# EasyEDA Pro project CW-LINK.epro

# Schematic schematic
Create Date: 2023-11-06; Page Name: CW; Project Name: CW1; Schematic Name: schematic2; Update Date: 2023-11-06; Company: 嘉立创EDA; Page Size: A4; Version: V1.0
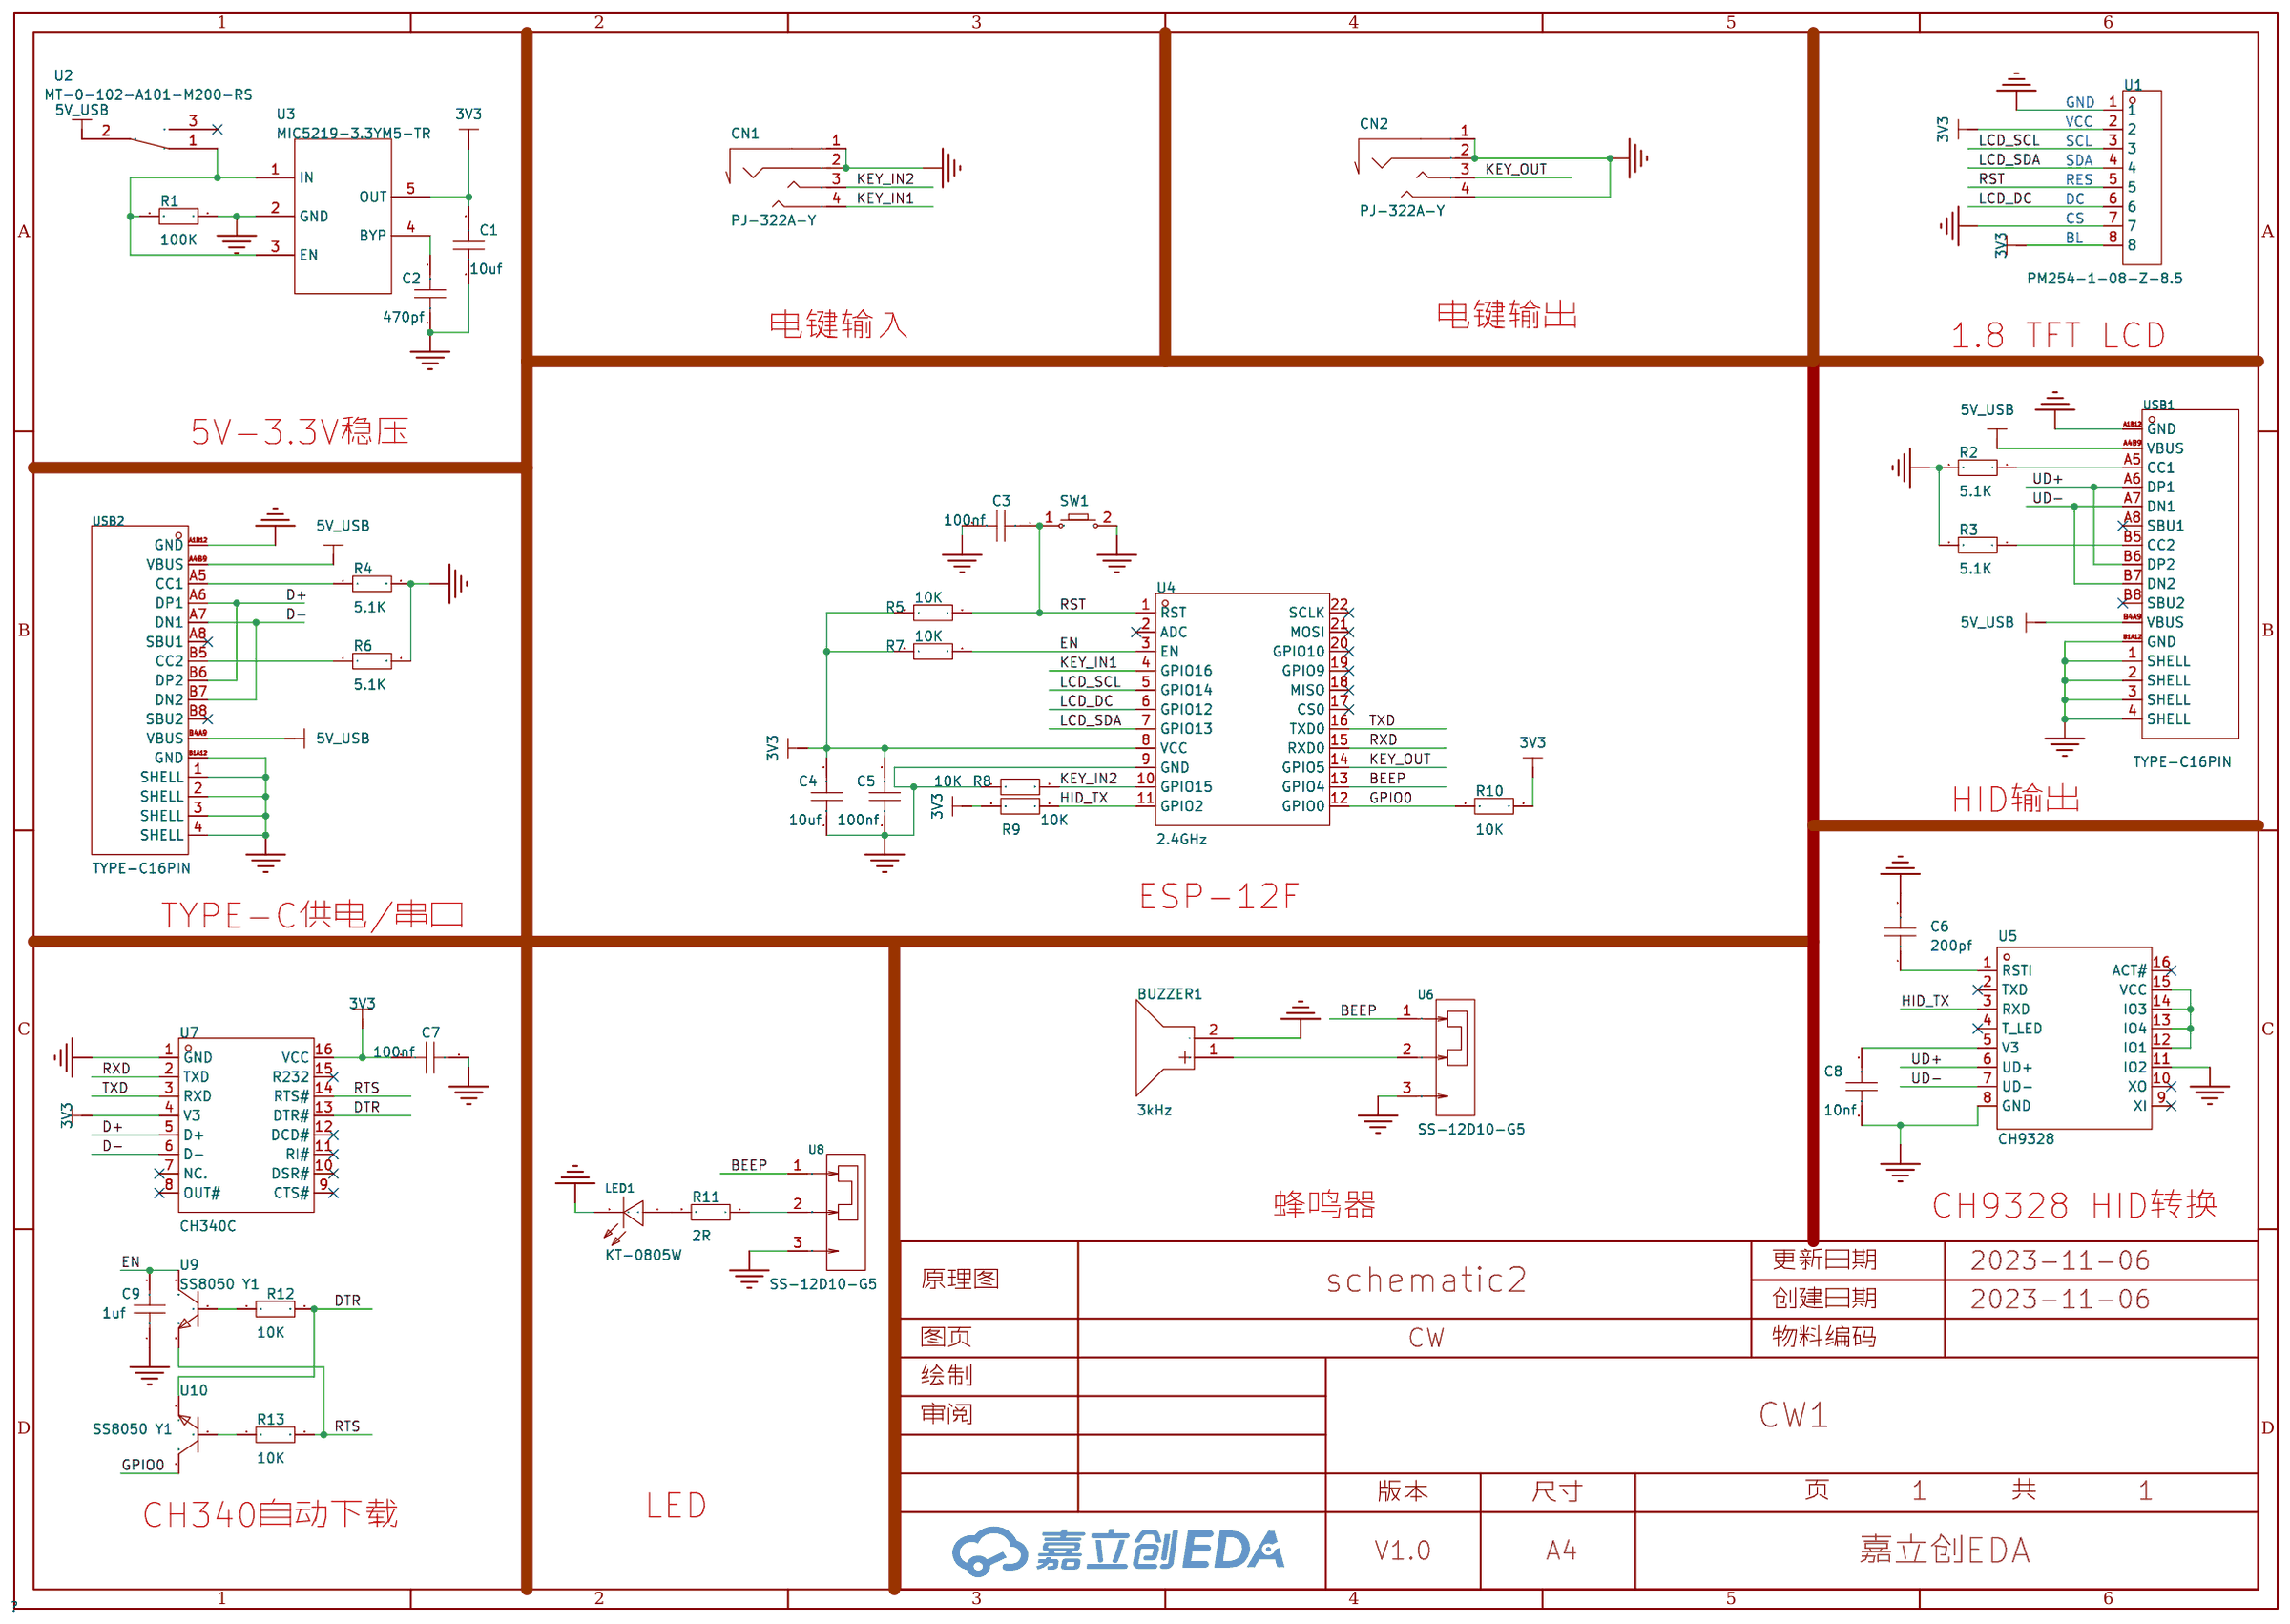
[diagram p0: schematic sheet]

## Parts
BUZZER1  3kHz  [BUZ-TH_BD9.0-P5.00-D0.6-FD]
C1  10uf  [C0603]
C2  470pf  [C0603]
C3  100nf  [C0603]
C4  10uf  [C0603]
C5  100nf  [C0603]
C6  200pf  [C0603]
C7  100nf  [C0603]
C8  10nf  [C0603]
C9  1uf  [C0603]
CN1  PJ-322A-Y  [AUDIO-TH_PJ-322A-Y]
CN2  PJ-322A-Y  [AUDIO-TH_PJ-322A-Y]
LED1  KT-0805W  [LED0805-R-RD]
R1  100K  [R0603]
R2  5.1K  [R0603]
R3  5.1K  [R0603]
R4  5.1K  [R0603]
R5  10K  [R0603]
R6  5.1K  [R0603]
R7  10K  [R0603]
R8  10K  [R0603]
R9  10K  [R0603]
R10  10K  [R0603]
R11  2R  [R0603]
R12  10K  [R0603]
R13  10K  [R0603]
SW1  -  [Key_SMD_3x4x2]
U1  PM254-1-08-Z-8.5  [HDR-TH_8P-P2.54-V-F]
U2  MT-0-102-A101-M200-RS  [SW-TH_MT-0-103-A101-M200-RS]
U3  MIC5219-3.3YM5-TR  [SOT-23-5_L3.0-W1.7-P0.95-LS2.8-TL]
U4  2.4GHz  [WIFIM-SMD_ESP-12F-ESP8266MOD]
U5  CH9328  [SOP-16_L10.0-W3.9-P1.27-LS6.0-BL]
U6  SS-12D10-G5  [SW-TH_SS-12D10-G050]
U7  CH340C  [SOP-16_L10.0-W3.9-P1.27-LS6.0-BL]
U8  SS-12D10-G5  [SW-TH_SS-12D10-G050]
U9  SS8050 Y1  [SOT-23-3_L2.9-W1.3-P1.90-LS2.4-BR]
U10  SS8050 Y1  [SOT-23-3_L2.9-W1.3-P1.90-LS2.4-BR]
USB1  TYPE-C16PIN  [USB-C-SMD_TYPE-C16PIN]
USB2  TYPE-C16PIN  [USB-C-SMD_TYPE-C16PIN]

## Library data of the parts
BUZZER1 = HNB09A03: 驱动方式:有源(内含驱动线路);构造类型:电磁式;额定电压:3V;工作电压:1.5V~4.5V;消耗电流:30mA;频率:3kHz;声压(SPL):85dB@10cm;直径(φD):9mm;长度:-;宽度:-;高度:5.5mm;工作温度:-20℃~+70℃;; LCSC Part Name: 电磁式有源一体蜂鸣器HNB09A03; Supplier Part: C96102; Manufacturer: 华能; Supplier Footprint: 插件,D=9mm; JLCPCB Part Class: 扩展库; Datasheet: https://atta.szlcsc.com/upload/public/pdf/source/20170522/1495448326172.pdf; Supplier: LCSC; Oscillator Circuit: 有源(内含驱动线路); Technology Type: 电磁式; Rated Voltage: 3V; Operating Voltage: 1.5V~4.5V; Current Consumption: 30mA; Sound Pressure Level (SPL): 85dB@10cm; Diameter (φD): 9mm; Height: 5.5mm; Operating Temperature: -20℃~+70℃
C1-C9 = CAP_0603: Supplier Footprint: 0603; Check: false
CN1 CN2 = PJ-322A-Y: 连接器类型:3.5mm耳机座;额定电流:500mA;额定电压:30V;工作温度范围:-20℃~+70℃;焊接温度(最大值):235℃;; LCSC Part Name: 3.5mm耳机座 5脚4级插脚; Supplier Part: C692437; Manufacturer: XKB Connectivity(中国星坤); Supplier Footprint: 插件; JLCPCB Part Class: 扩展库; Datasheet: https://atta.szlcsc.com/upload/public/pdf/source/20211011/A7724924910CB45E8E030AEFF3716BF0.pdf; Supplier: LCSC; Connector Type: 3.5mm耳机座; Current Rating (Max): 500mA; Voltage Rating (Max): 30V; Operating Temperature Range: -20℃~+70℃; Welding Temperature (Max): 235℃
LED1 = KT-0805W: 色温6000K左右; LCSC Part Name: 0805 白灯 高亮; Supplier Part: C34499; Manufacturer: KENTO; Supplier Footprint: 0805; JLCPCB Part Class: 基础库; Datasheet: https://atta.szlcsc.com/upload/public/pdf/source/20221124/DAA20402FFC1FB071B8B6797757426FE.pdf; Supplier: LCSC
R1-R13 = Res_0603: Supplier Footprint: 0603; Check: false
SW1 = Key_SMD_3x4x2: Supplier Footprint: SMD; Check: false
U1 = PM254-1-08-Z-8.5: 排数:单排;总孔位数:8P;间距:2.54mm;插孔结构:1x8P;行距:-;安装类型:直插;圆孔/方孔:方孔;额定电流:3A;额定电压:-;插孔方向:顶部;塑高:8.5mm;工作温度范围:-40℃~+105℃;; LCSC Part Name: 间距:2.54mm 1x8P 直插; Supplier Part: C2897371; Manufacturer: HCTL(华灿天禄); Supplier Footprint: 插件,P=2.54mm; JLCPCB Part Class: 扩展库; Datasheet: https://atta.szlcsc.com/upload/public/pdf/source/20230609/534BE42964C679BDE98E061007C4ABD6.pdf; Supplier: LCSC; Number of Rows: 单排; Number of Holes: 8P; Pitch: 2.54mm; Holes Structure: 1x8P; Mounting Type: 直插; Circular Hole / Square Hole: 方孔; Current Rating (Max): 3A; Holes Direction: 顶部; Insulation Height: 8.5mm; Operating Temperature Range: -40℃~+105℃
U2 = MT-0-102-A101-M200-RS: 额定电流:5A;额定电压(AC):125V;电路结构:单刀双掷;机械寿命:-;安装方式:直插;; LCSC Part Name: 小型钮子三脚二档 五件套; Supplier Part: C1788492; Manufacturer: YUEN FUNG(源丰); Supplier Footprint: 插件; JLCPCB Part Class: 扩展库; Datasheet: https://atta.szlcsc.com/upload/public/pdf/source/20230720/8E5C36EFDF374AE4FF4AC09DB233CE0E.pdf; Supplier: LCSC; Contact Current: 5A; Voltage Rating (AC): 125V; Circuit: 单刀双掷; Actuator Type: 圆柱钮柄; Pin Style: 焊片; Mounting Style: 直插; Operating Temperature: -25℃~+85℃; Switch Length: 13mm; Switch Width: 8mm; Switch Height: 28.6mm
U3 = MIC5219-3.3YM5-TR: 输出类型:-;; Supplier Part: C29613; Manufacturer: MICROCHIP(美国微芯); Supplier Footprint: SOT-23-5; JLCPCB Part Class: 扩展库; Datasheet: https://atta.szlcsc.com/upload/public/pdf/source/20140411/1457707042508.pdf; Supplier: LCSC
U4 = ESP-12F(ESP8266MOD): 频率:2.4GHz;发射功率:16dBm;核心处理器:ESP8266;天线形式:PCB 板载天线;接收灵敏度:-90dBm;; LCSC Part Name: 完整的802.11b/g/n Wi-Fi的SoC模块; Supplier Part: C82891; Manufacturer: Ai-Thinker(安信可); Supplier Footprint: SMD,16x24mm; JLCPCB Part Class: 扩展库; Datasheet: https://atta.szlcsc.com/upload/public/pdf/source/20210219/C82891_ABD84A460F4F056A2757267CCCA4B508.pdf; Supplier: LCSC; Output Power: 16dBm; Core Processor: ESP8266; Support Interface: GPIO；UART；I2C；PWM；SPI；ADC; Antenna Type: PCB 板载天线; Wireless Standard: 802.11b/g/n; Operating Voltage: 3.3V; Receive  Current: 120mA; Send  Current: 170mA; Sensitivity: -90dBm; Operating Temperature: -40℃~+85℃
U5 = CH9328: 应用功能:收发器;接口协议:USB 2.0;数据速率:12Mbps;; Supplier Part: C82452; Manufacturer: WCH(南京沁恒); Supplier Footprint: SOP-16; JLCPCB Part Class: 扩展库; Datasheet: https://atta.szlcsc.com/upload/public/pdf/source/20200903/C82452_2CB77B87B2D4A08CA0C06489A1962735.pdf; Supplier: LCSC; Applications Function: 收发器; Protocol: USB 2.0; Data Rate: 12Mbps; Supply Voltage: 3.3V；5V
U6 U8 = SS-12D10-G5: 电路结构:单刀双掷;安装方式:直插;机械寿命:-;开关颜色:黑色;; LCSC Part Name: 插件大电流拨动开关; Supplier Part: C2998777; Manufacturer: DEALON(德艺隆); Supplier Footprint: 插件; JLCPCB Part Class: 扩展库; Datasheet: https://atta.szlcsc.com/upload/public/pdf/source/20220428/E10CB334ACBAF32CF4AF8D87DA871CD3.pdf; Supplier: LCSC; Circuit: 单刀双掷; Mounting Style: 直插; Actuator Color: 黑色; Actuator Style: 矩形柱状; Pin Style: PC引脚; Switch Length: 12.7mm; Switch Width: 6.7mm; Switch Height: 11.3mm
U7 = CH340C: 应用功能:收发器;接口协议:USB 2.0;数据速率:2Mbps;; LCSC Part Name: CH340C USB转串口芯片 CH340; Supplier Part: C84681; Manufacturer: WCH(南京沁恒); Supplier Footprint: SOP-16; JLCPCB Part Class: 扩展库; Datasheet: https://atta.szlcsc.com/upload/public/pdf/source/20200819/C84681_ADBED554CE321879DBD6B1D06488689C.pdf; Supplier: LCSC; Applications Function: 收发器; Protocol: USB 2.0; Data Rate: 2Mbps; Supply Voltage: 3.3V；5V
U9 U10 = SS8050 Y1_C5365361: 晶体管类型:NPN;集射极击穿电压(Vceo):25V;集电极电流(Ic):1.5A;功率(Pd):300mW;直流电流增益(hFE@Ic,Vce):120@100mA,1V;; LCSC Part Name: NPN 25V 1.5A; Supplier Part: C5365361; Manufacturer: JUXING(钜兴); Supplier Footprint: SOT-23; JLCPCB Part Class: 扩展库; Datasheet: https://atta.szlcsc.com/upload/public/pdf/source/20230308/FB5646DC857F3944E2D1F5B10247AD70.pdf; Supplier: LCSC; Transistor Type: NPN; Collector-Emitter Breakdown Voltage (Vceo): 25V; Collector Current (Ic): 1.5A; Power Dissipation (Pd): 300mW; Collector Cut-Off Current (Icbo): 100nA; Collector-Emitter Saturation Voltage (VCE(sat)@Ic,Ib): 500mV@800mA,80mA; DC Current Gain (hFE@Ic,Vce): 120@100mA,1V; Transition Frequency (fT): 100MHz; Operating Temperature: +150℃@(Tj)
USB1 USB2 = TYPE-C16PIN: 连接器类型:Type-C;标准:-;公母:母座;触点数量:16P;端口数量:1;安装方式:卧贴;额定电流 - 电源:3A;工作温度范围:-40℃~+85℃;; LCSC Part Name: Type-C 母座 卧贴 快充闪充; Supplier Part: C393939; Manufacturer: SHOU HAN(首韩); Supplier Footprint: SMD; JLCPCB Part Class: 扩展库; Datasheet: https://atta.szlcsc.com/upload/public/pdf/source/20190521/C393939_7B9043D4CF1026AF443AB60D91FBCD5C.pdf; Supplier: LCSC; Connector Type: Type-C; Gender: 母座; Number of Contacts: 16P; Number of Ports: 1; Mounting Style: 卧贴; Current Rating - Power (Max): 3A; Operating Temperature Range: -40℃~+85℃

## Nets
3V3: C1.2 C4.2 C5.2 C7.1 R5.1 R7.1 R9.2 R10.2 U1.2 U1.8 U3.5(OUT) U4.8(VCC) U7.4(V3) U7.16(VCC)
5V_USB: U2.2 USB1.A4B9(VBUS) USB1.B4A9(VBUS) USB2.A4B9(VBUS) USB2.B4A9(VBUS)
GND: BUZZER1.2(-) C1.1 C2.1 C3.2 C4.1 C5.1 C6.2 C7.2 C8.1 C9.1 CN1.1 CN1.2 CN2.1 CN2.2 CN2.4 LED1.2(K) R1.1 R2.2 R3.2 R4.2 R6.2 R8.1 SW1.2 U1.1 U1.7 U3.2(GND) U4.9(GND) U5.8(GND) U5.11(IO2) U6.3 U7.1(GND) U8.3 USB1.1(SHELL) USB1.2(SHELL) USB1.3(SHELL) USB1.4(SHELL) USB1.A1B12(GND) USB1.B1A12(GND) USB2.1(SHELL) USB2.2(SHELL) USB2.3(SHELL) USB2.4(SHELL) USB2.A1B12(GND) USB2.B1A12(GND)
BEEP: U4.13(GPIO4) U6.1 U8.1
D+: U7.5(D+) USB2.A6(DP1) USB2.B6(DP2)
D-: U7.6(D-) USB2.A7(DN1) USB2.B7(DN2)
DTR: R12.2 U7.13(DTR#) U10.2(E)
EN: C9.2 R7.2 U4.3(EN) U9.3(C)
GPIO0: R10.1 U4.12(GPIO0) U10.3(C)
HID_TX: R9.1 U4.11(GPIO2) U5.3(RXD)
KEY_IN1: CN1.4 U4.4(GPIO16)
KEY_IN2: CN1.3 R8.2 U4.10(GPIO15)
KEY_OUT: CN2.3 U4.14(GPIO5)
LCD_DC: U1.6 U4.6(GPIO12)
LCD_SCL: U1.3 U4.5(GPIO14)
LCD_SDA: U1.4 U4.7(GPIO13)
RST: C3.1 R5.2 SW1.1 U1.5 U4.1(RST)
RTS: R13.2 U7.14(RTS#) U9.2(E)
RXD: U4.15(RXD0) U7.2(TXD)
TXD: U4.16(TXD0) U7.3(RXD)
UD+: U5.6(UD+) USB1.A6(DP1) USB1.B6(DP2)
UD-: U5.7(UD-) USB1.A7(DN1) USB1.B7(DN2)
$3N2016: C2.2 U3.4(BYP)
$3N2525: R4.1 USB2.A5(CC1)
$3N2666: R6.1 USB2.B5(CC2)
$3N3364: R12.1 U9.1(B)
$3N3367: R13.1 U10.1(B)
$3N4807: C6.1 U5.1(RSTI)
$3N4819: C8.2 U5.5(V3)
$3N5016: U5.12(IO1) U5.13(IO4) U5.14(IO3) U5.15(VCC)
$3N5212: R2.1 USB1.A5(CC1)
$3N5218: R3.1 USB1.B5(CC2)
$3N5338: BUZZER1.1(+) U6.2
$3N5513: R1.2 U2.1 U3.1(IN) U3.3(EN)
$3N5795: R11.1 U8.2
$3N5844: LED1.1(A) R11.2

Not connected (* = marked no-connect by the designer): U2 3*; U4 2(ADC)* 17(CS0)* 18(MISO)* 19(GPIO9)* 20(GPIO10)* 21(MOSI)* 22(SCLK)*; U5 2(TXD)* 4(T_LED)* 9(XI)* 10(XO)* 16(ACT#)*; U7 7(NC.)* 8(OUT#)* 9(CTS#)* 10(DSR#)* 11(RI#)* 12(DCD#)* 15(R232)*; USB1 A8(SBU1)* B8(SBU2)*; USB2 A8(SBU1)* B8(SBU2)*

## Notes on the sheet
- GND
- VCC
- SCL
- SDA
- DC
- RES
- CS
- BL
- 电键输入
- 电键输出
- 1.8 TFT LCD
- 5V-3.3V稳压
- HID输出
- ESP-12F
- TYPE-C供电/串口
- 蜂鸣器
- CH9328 HID转换
- CH340自动下载
- LED

# Board CW-LINK
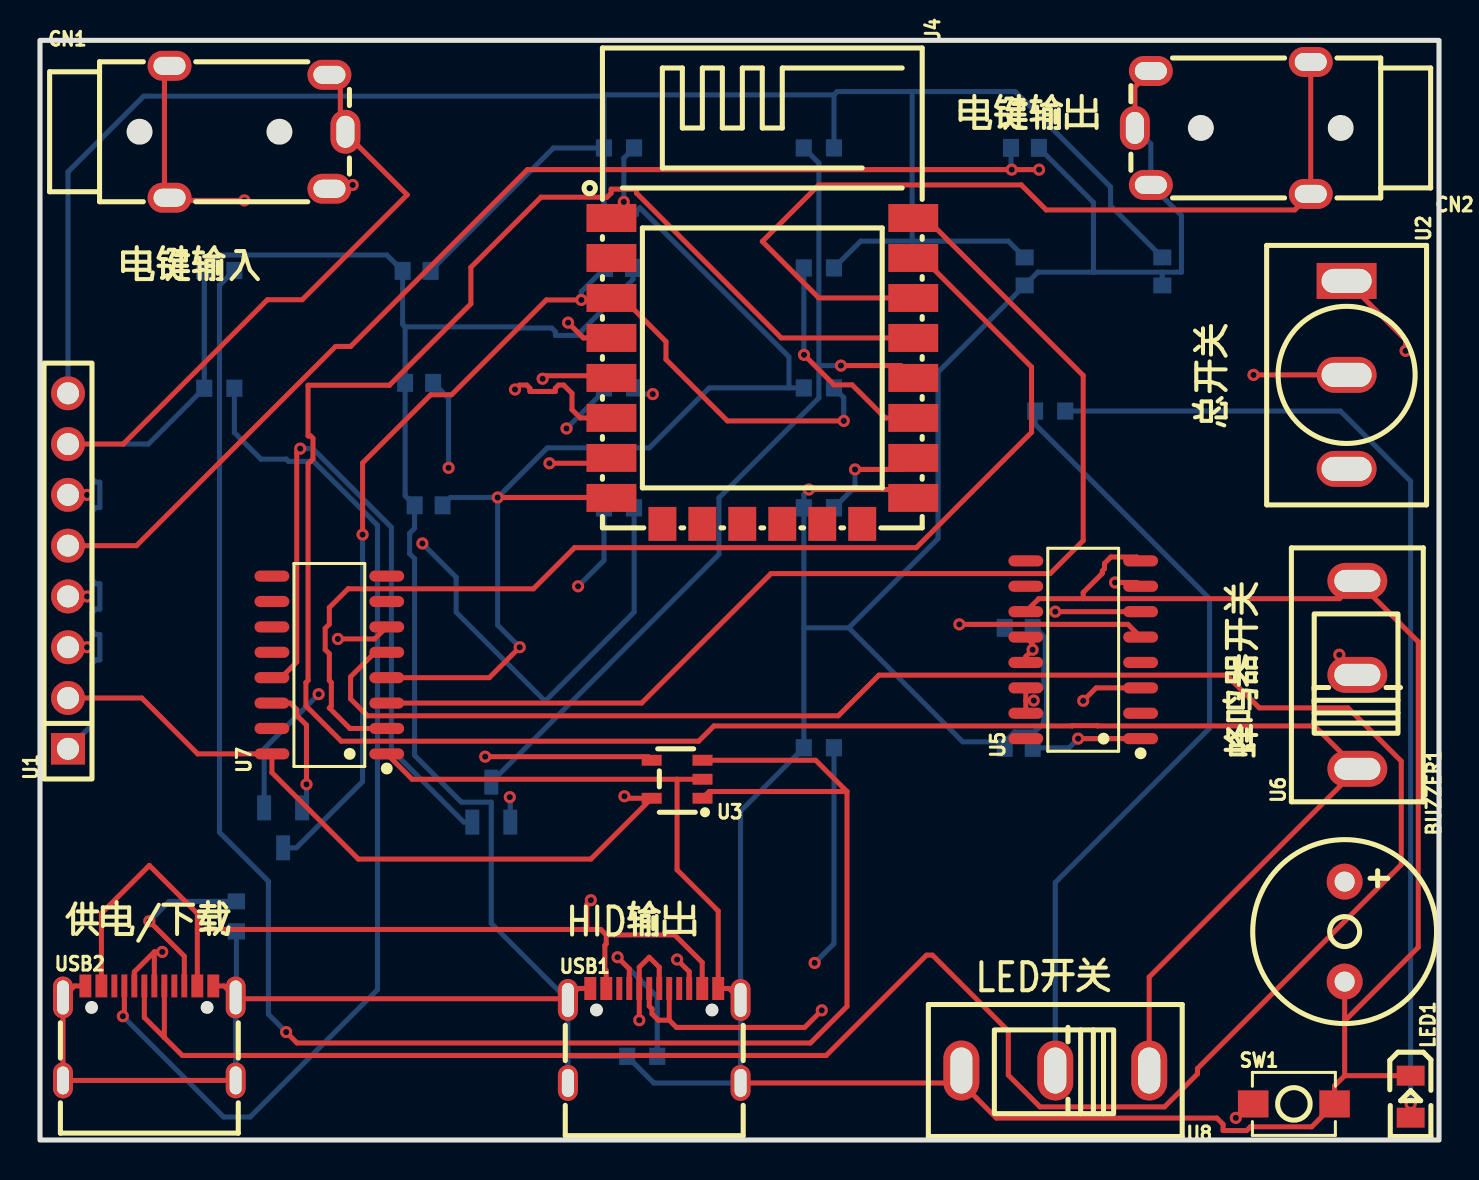
[diagram p1: board, top side]
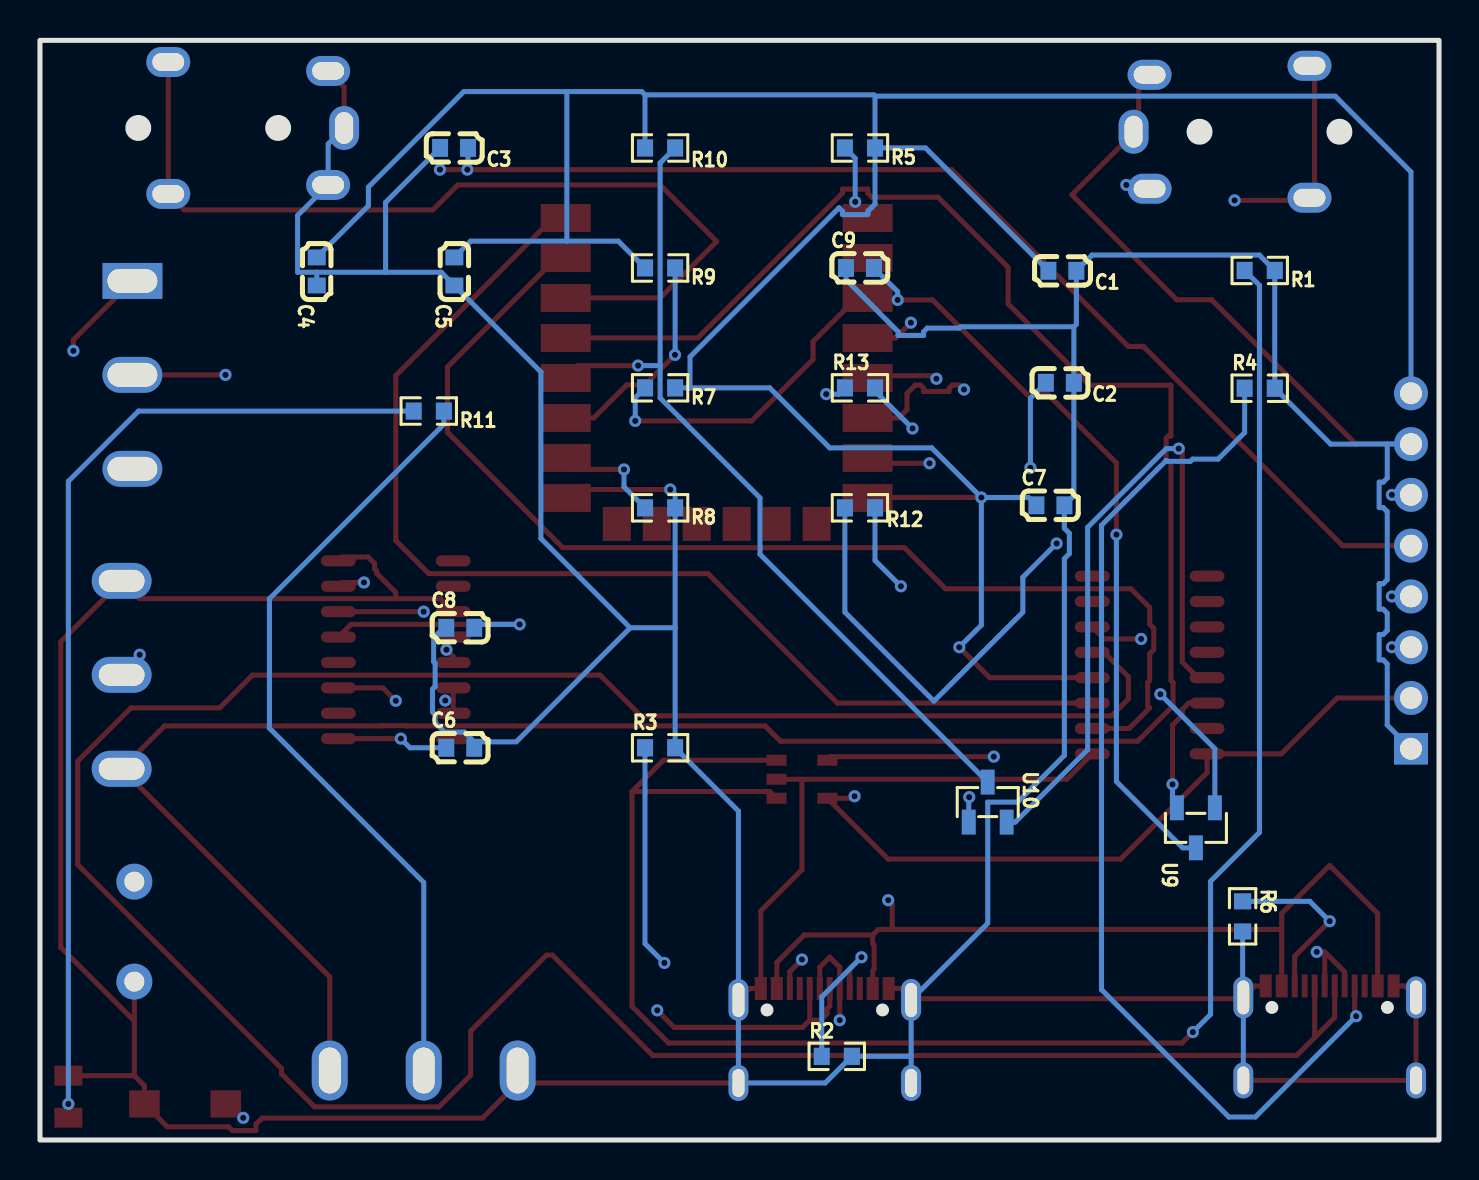
[diagram p2: board, bottom side, seen from below]

Outline 70 x 55 mm; copper layers: Top Layer, Inner1, Inner2, Bottom Layer. Coordinates in mm from the lower left corner of the outline.
Outline path: rectangle 0,55 70,0
Stack: Top Layer 0.035mm 外层铜厚1oz / Dielectric1 0.2104mm 7628 RC49% 8.6mil / Inner1 0.0152mm 内层铜厚 / Dielectric2 1.065mm 1.1mm H/HOZ 含铜 / Inner2 0.0152mm 内层铜厚 / Dielectric3 0.2104mm 7628 RC49% 8.6mil / Bottom Layer 0.035mm 外层铜厚1oz

## Design rules (mm)
template: 自定义配置
spacing copperThickness1oz (default): track to track 0.102, other pairs 0.152 to 0.3
spacing copperThickness2oz: track to track 0.203, other pairs 0.152 to 0.3
track width copperThickness1oz (default): min 0.127, default 0.254, max 2.54
track width normal: min 0.254, default 0.254, max 0.5
differential pair differentialPair (default): width min 0.127, default 0.254, max 2.54; gap min 0.152, default 0.152
via viaSize (default): diameter min 0.5, default 0.61, max 10; hole min 0.3, default 0.305, max 6.299
net TXD uses normal
net RXD uses normal
net KEY_OUT uses normal
net GPIO0 uses normal
net HID_TX uses normal
net KEY_IN2 uses normal
net LCD_SDA uses normal
net LCD_DC uses normal
net LCD_SCL uses normal
net KEY_IN1 uses normal
net EN uses normal
net RST uses normal
net $3N2016 uses normal
net $3N5513 uses normal
net $3N2666 uses normal
net D+ uses normal
net D- uses normal
net $3N2525 uses normal
net RTS uses normal
net DTR uses normal
net $3N3364 uses normal
net $3N3367 uses normal
net $3N4807 uses normal
net $3N4819 uses normal
net UD+ uses normal
net UD- uses normal
net $3N5016 uses normal
net $3N5218 uses normal
net $3N5212 uses normal
net $3N5338 uses normal
net $3N5795 uses normal
net $3N5844 uses normal

## Placement (name value [footprint] x y rotation side)
BUZZER1  3kHz  [BUZ-TH_BD9.0-P5.00-D0.6-FD]  65.28 10.42 270 top
C1  10uf  [C0603]  18.84 43.47 0 bottom
C2  470pf  [C0603]  18.97 37.87 0 bottom
C3  100nf  [C0603]  49.28 49.62 0 bottom
C4  10uf  [C0603]  56.15 43.44 90 bottom
C5  100nf  [C0603]  49.27 43.44 90 bottom
C6  200pf  [C0603]  48.97 19.62 180 bottom
C7  100nf  [C0603]  19.45 31.74 180 bottom
C8  10nf  [C0603]  48.97 25.62 180 bottom
C9  1uf  [C0603]  28.97 43.62 180 bottom
CN1  PJ-322A-Y  [AUDIO-TH_PJ-322A-Y]  10.88 50.43 0 top
CN2  PJ-322A-Y  [AUDIO-TH_PJ-322A-Y]  59.18 50.62 180 top
LED1  KT-0805W  [LED0805-R-RD]  68.58 2.17 270 top
R1  100K  [R0603]  8.97 43.49 0 bottom
R2  5.1K  [R0603]  30.13 4.19 180 bottom
R3  5.1K  [R0603]  38.97 19.62 180 bottom
R4  5.1K  [R0603]  8.97 37.6 180 bottom
R5  10K  [R0603]  28.97 49.62 0 bottom
R6  5.1K  [R0603]  9.83 11.18 270 bottom
R7  10K  [R0603]  38.97 37.62 0 bottom
R8  10K  [R0603]  38.97 31.62 0 bottom
R9  10K  [R0603]  38.97 43.62 0 bottom
R10  10K  [R0603]  38.97 49.62 0 bottom
R11  2R  [R0603]  50.55 36.46 0 bottom
R12  10K  [R0603]  28.97 31.62 0 bottom
R13  10K  [R0603]  28.97 37.62 180 bottom
SW1  -  [Key_SMD_3x4x2]  62.74 1.81 0 top
U1  PM254-1-08-Z-8.5  [HDR-TH_8P-P2.54-V-F]  1.4 28.46 90 top
U2  MT-0-102-A101-M200-RS  [SW-TH_MT-0-103-A101-M200-RS]  65.38 38.27 270 top
U3  MIC5219-3.3YM5-TR  [SOT-23-5_L3.0-W1.7-P0.95-LS2.8-TL]  31.88 18.04 180 top
U4  2.4GHz  [WIFIM-SMD_ESP-12F-ESP8266MOD]  36.14 38.46 270 top
U5  CH9328  [SOP-16_L10.0-W3.9-P1.27-LS6.0-BL]  52.2 24.52 90 top
U6  SS-12D10-G5  [SW-TH_SS-12D10-G050]  65.91 23.27 90 top
U7  CH340C  [SOP-16_L10.0-W3.9-P1.27-LS6.0-BL]  14.48 23.76 90 top
U8  SS-12D10-G5  [SW-TH_SS-12D10-G050]  50.8 3.48 180 top
U9  SS8050 Y1  [SOT-23-3_L2.9-W1.3-P1.90-LS2.4-BR]  12.17 15.61 90 bottom
U10  SS8050 Y1  [SOT-23-3_L2.9-W1.3-P1.90-LS2.4-BR]  22.58 16.9 270 bottom
USB1  TYPE-C16PIN  [USB-C-SMD_TYPE-C16PIN]  30.73 5.22 0 top
USB2  TYPE-C16PIN  [USB-C-SMD_TYPE-C16PIN]  5.47 5.34 0 top

## Footprints (pads in the part's own frame, mm; a bottom-side part is the same pattern mirrored in y, then rotated)
AUDIO-TH_PJ-322A-Y
  oval 1.5x2.2 hole 0.9x1.6: 1(4.4,0)
  oval 2.2x1.5 hole 1.6x0.9: 2(3.6,2.85) 3(-4.4,3.3) 3(-4.4,-3.3) 4(3.6,-2.85)
BUZ-TH_BD9.0-P5.00-D0.6-FD
  round 1.8 hole 1: 1(-2.5,0) 2(2.5,0)
C0603
  rect 0.8x0.9 smd: 1(-0.7,0) 2(0.7,0)
HDR-TH_8P-P2.54-V-F
  rect 1.575x1.7 hole 1.1: 1(-8.89,0)
  round 1.7 hole 1.1: 2(-6.35,0) 3(-3.81,0) 4(-1.27,0) 5(1.27,0) 6(3.81,0) 7(6.35,0) 8(8.89,0)
Key_SMD_3x4x2
  rect 1.53x1.36 smd: 1(-2.035,0) 2(2.035,0)
LED0805-R-RD
  rect 1x1.399 smd: 1(1.05,0) 2(-1.05,0)
R0603
  rect 0.806x0.864 smd: 1(-0.753,0) 2(0.753,0)
SOP-16_L10.0-W3.9-P1.27-LS6.0-BL
  oval 0.56x1.745 smd: 1(-4.445,-2.873) 2(-3.175,-2.873) 3(-1.905,-2.873) 4(-0.635,-2.873) 5(0.635,-2.873) 6(1.905,-2.873) 7(3.175,-2.873) 8(4.445,-2.873) 9(4.445,2.873) 10(3.175,2.873) 11(1.905,2.873) 12(0.635,2.873) 13(-0.635,2.873) 14(-1.905,2.873) 15(-3.175,2.873) 16(-4.445,2.873)
SOT-23-3_L2.9-W1.3-P1.90-LS2.4-BR
  rect 1.25x0.7 smd: 1(1,-0.95) 2(1,0.95) 3(-1,0)
SOT-23-5_L3.0-W1.7-P0.95-LS2.8-TL
  rect 1x0.55 smd: 1(-1.272,0.95) 2(-1.272,0) 3(-1.272,-0.95) 4(1.272,-0.95) 5(1.272,0.95)
SW-TH_MT-0-103-A101-M200-RS
  rect 1.8x3 hole 1.2x2.5: 1(-4.7,0)
  oval 1.8x3 hole 1.2x2.5: 2(0,0) 3(4.7,0)
SW-TH_SS-12D10-G050
  oval 1.8x3 hole 1.1x2.3: 1(-4.7,0) 2(0,0) 3(4.7,0)
USB-C-SMD_TYPE-C16PIN
  oval 1x2.1 hole 0.6x1.7: 1(-4.32,1.788) 2(4.32,1.788)
  oval 1x1.8 hole 0.6x1.4: 3(-4.32,-2.362) 4(4.32,-2.362)
  rect 0.6x1.15 smd: A1B12(-3.2,2.362) A4B9(-2.4,2.362) B1A12(3.2,2.362) B4A9(2.4,2.362)
  rect 0.3x1.15 smd: A5(-1.25,2.362) A6(-0.25,2.362) A7(0.25,2.362) A8(-1.75,2.362) B5(1.75,2.362) B6(0.75,2.362) B7(-0.75,2.362) B8(1.25,2.362)
WIFIM-SMD_ESP-12F-ESP8266MOD
  rect 1.4x2.5 smd: 1(-7.651,-7.551) 2(-5.651,-7.551) 3(-3.651,-7.551) 4(-1.651,-7.551) 5(0.349,-7.551) 6(2.349,-7.551) 7(4.349,-7.551) 8(6.349,-7.551) 9(6.349,7.548) 10(4.349,7.55) 11(2.349,7.551) 12(0.349,7.551) 13(-1.651,7.55) 14(-3.651,7.551) 15(-5.651,7.551) 16(-7.651,7.551)
  rect 1.7x1.4 smd: 17(7.651,-5) 18(7.649,-3.002) 19(7.649,-1.004) 20(7.649,0.998) 21(7.649,2.997) 22(7.651,4.997)

## Nets
As in the schematic.

Pads without a net: U2 3; U4 2 17 18 19 20 21 22; U5 2 4 9 10 16; U7 7 8 9 10 11 12 15; USB1 A8 B8; USB2 A8 B8

## Via types
v1: diameter 0.61, hole 0.305, Top Layer to Bottom Layer, 55 vias

## Routing (per net, layer and track width the routed paths; a pad name or vN(x,y) marks a point on that pad's centre or on a via; arc(x,y) is an arc through that point)
3V3: length 209.9
  Top Layer w0.254: v1(22.9,32.14) 28.57,32.14 U4.8 ; U7.4 22.48,23.12 v1(24,24.65) ; U1.2 5.1,22.11 7.89,19.31 U7.16 11.61,18.38 15.93,14.05 27.56,14.05 U3.5 29.34,17.09 v1(29.24,17.19)
  Inner1 w0.254: v1(24,24.65) 29.24,19.41 v1(29.24,17.19)
  Bottom Layer w0.254: 37.48,37.62 33.49,37.62 30.49,34.62 25.38,34.62 v1(22.9,32.14) ; 37.48,37.62 37.48,39.17 30.02,46.63 29.85,46.46 29.85,46.29 28.58,46.29 28.58,46.46 28.4,46.63 28.4,46.63 28.22,46.81 R5.1 ; 37.48,37.62 R7.1 ; v1(22.9,32.14) 22.9,25.75 v1(24,24.65) ; v1(22.9,32.14) 20.54,32.14 C7.1 ; 39.73,52.27 28.28,52.27 28.22,52.21 ; 39.73,52.27 39.89,52.44 43.64,52.44 ; 39.73,52.27 R10.2 ; 28.22,52.21 R5.1 ; 28.22,52.21 5.19,52.21 1.4,48.42 U1.8 ; R5.1 25.69,49.62 C1.2 ; 43.64,44.96 48.45,44.96 C5.2 ; 43.64,44.96 43.64,52.44 ; 43.64,44.96 41.06,44.96 R9.2 ; C4.2 53.57,46.73 53.57,47.66 48.79,52.44 43.64,52.44
5V_USB: length 100.5
  Top Layer w0.254: USB2.A4B9 3.07,11.33 5.47,13.73 7.87,11.33 7.87,10.53 ; 7.87,10.53 USB2.B4A9 ; 7.87,10.53 27.36,10.53 ; 27.36,10.53 27.36,11.79 v1(27.56,11.99) ; 27.36,10.53 28.06,10.53 28.33,10.26 ; 28.33,10.26 31.76,10.26 33.13,8.88 USB1.B4A9 ; 28.33,10.26 28.33,9.81 28.26,9.74 28.26,8.54 28.33,8.47 USB1.A4B9 ; v1(60.72,38.27) U2.2
  Inner2 w0.254: v1(27.56,11.99) 45,11.99 60.72,27.71 v1(60.72,38.27)
GND: length 402.8
  Top Layer w0.254: v1(38.47,32.53) 43.27,32.53 U4.9 ; U1.7 4.16,34.81 11.38,42.03 13.12,42.03 18.37,47.27 15.03,50.62 15.03,52.67 14.23,53.47 ; 46.1,2.85 47.86,1.1 58.88,1.1 59.2,0.79 59.2,0.47 60.37,0.47 60.56,0.66 63.63,0.66 SW1.2 64.77,2.71 65.28,3.22 ; 46.1,2.85 USB1.4 ; 46.1,2.85 U8.3 ; USB2.A1B12 1.73,7.71 USB2.1 USB2.3 USB2.4 ; 65.28,5.96 65.28,3.22 ; 65.28,5.96 68.96,9.64 68.96,24.92 U6.3 65.02,27.08 52.2,27.08 ; 65.28,5.96 BUZZER1.2 ; 65.28,3.22 LED1.2 ; USB1.A1B12 26.92,7.58 26.41,7.07 ; U3.2 31.88,18.04 ; 31.88,18.04 18.62,18.04 U7.1 ; 31.88,18.04 31.88,13.51 33.93,11.46 USB1.B1A12 34.48,7.58 USB1.2 ; 52.2,27.08 52.2,27.38 53.16,28.34 53.16,28.47 53.26,28.57 53.26,28.84 53.58,29.16 54.88,29.16 U5.8 ; 52.2,27.08 49.97,27.08 U5.11 ; USB2.B1A12 9.22,7.71 USB2.2 9.85,7.07 26.41,7.07 ; CN2.4 54.78,52.67 CN2.1 ; 26.41,7.07 USB1.1
  Bottom Layer w0.254: 52.71,43.4 52.71,46.89 C3.2 ; 52.71,43.4 49.93,43.4 C5.1 44.94,38.41 44.94,30.09 40.47,25.62 ; 52.71,43.4 56.15,43.4 ; 48.27,19.91 48.77,20.41 49.76,20.41 50.23,20.88 50.23,21.28 50.36,21.41 50.36,22.55 50.23,22.68 50.23,23.85 50.3,23.92 50.3,25.12 49.8,25.62 C8.1 ; 48.27,19.91 46.17,19.91 40.47,25.62 ; 48.27,19.91 C6.2 ; v1(38.47,32.53) 38.22,32.29 R8.1 38.22,25.62 ; 2.59,34.81 2.59,33.1 2.79,32.9 2.99,32.9 2.99,31.63 2.79,31.63 2.59,31.43 2.59,28.02 2.79,27.82 2.99,27.82 2.99,26.55 2.79,26.55 2.59,26.35 2.59,25.48 2.79,25.28 2.99,25.28 2.99,24.01 2.79,24.01 2.59,23.81 2.59,20.76 U1.1 ; 2.59,34.81 U1.7 ; 2.59,34.81 5.42,34.81 R4.2 R1.1 8.99,44.26 17.36,44.26 C1.1 18.14,40.8 18.27,40.67 ; 40.47,25.62 38.22,25.62 ; 38.22,25.62 R3.2 35.05,16.45 USB1.2 USB1.4 30.71,2.85 R2.2 26.41,4.19 ; 18.27,40.67 C2.1 18.27,32.22 18.74,31.74 18.74,30.6 18.5,30.35 18.5,29.32 18.74,29.08 18.74,19.24 21.08,16.9 22.58,16.9 22.58,10.84 USB1.1 26.41,4.19 ; 18.27,40.67 23.94,40.67 24,40.61 25.61,40.61 25.79,40.43 25.79,40.24 27.06,40.24 27.06,40.43 29.67,43.04 C9.1 ; USB2.4 USB2.2 9.83,7.16 R6.2 ; 26.41,4.19 USB1.3 ; 56.15,43.4 57.11,43.4 57.11,46.24 CN2.2 55.58,49.82 CN2.1 ; 56.15,43.4 C4.1
BEEP: length 129
  Top Layer w0.254: U4.13 37.09,40.12 29.85,47.36 29.85,47.56 28.58,47.56 28.58,47.36 28.37,47.16 25.07,47.16 21.56,43.65 21.56,41.82 17.49,37.75 13.41,37.75 13.41,35.22 13.54,35.22 13.66,35.09 13.66,34.07 13.41,33.82 13.41,22.99 13.31,22.88 13.31,21.72 15.07,19.95 32.96,19.95 33.72,20.71 51.64,20.71 51.65,20.72 52.91,20.72 52.92,20.71 63.77,20.71 U6.1 55.5,8.15 U8.1
D+: length 143.7
  Top Layer w0.254: 6.22,5.13 5.22,6.13 USB2.A6 ; 6.22,5.13 7.12,4.23 39.34,4.23 44.35,9.25 44.66,9.25 48.45,5.45 48.45,3.24 50.04,1.66 56.26,1.66 57.91,3.31 57.91,3.58 68.11,13.77 68.11,18.95 65.45,21.61 61.01,21.61 59.37,23.25 41.97,23.25 39.94,21.22 16.38,21.22 15.54,22.06 15.54,23.17 16.76,24.39 U7.5 ; 6.22,5.13 USB2.B6
D-: length 28.5
  Top Layer w0.254: 5.72,9.41 v1(6.12,9.41) ; 5.72,9.41 USB2.A7 ; 5.72,9.41 4.72,8.41 USB2.B7 ; v1(14.91,25.06) 16.75,25.06 U7.6
  Inner1 w0.254: v1(14.91,25.06) 13.82,25.06 12.37,23.61 9.61,23.61 6.12,20.12 v1(6.12,9.41)
DTR: length 65.2
  Top Layer w0.254: U7.13 12.06,23.12 12.85,23.9 12.85,34.4 v1(13.02,34.58)
  Inner2 w0.254: v1(19.13,29.84) 14.39,34.58 v1(13.02,34.58)
  Bottom Layer w0.254: U10.2 21.2,15.9 17.58,19.52 17.58,30.65 13.65,34.58 v1(13.02,34.58) ; v1(19.13,29.84) 20.82,28.15 20.82,26.4 25.27,21.95 29.73,26.4 R12.2
EN: length 55.8
  Top Layer w0.254: v1(16.14,30.28) 16.14,33.86 19.55,37.27 20.59,37.27 25.34,42.02 v1(27.09,42.02) 28.49,42.02 U4.3 29.14,42.12 31.32,39.93 31.32,39.04 34.4,35.97 v1(40.22,35.97)
  Bottom Layer w0.254: U9.3 12.83,14.61 16.14,17.93 v1(16.14,30.28) ; v1(40.22,35.97) 40.22,37.13 R7.2 ; C9.2 27.09,42.43 v1(27.09,42.02)
GPIO0: length 43.8
  Top Layer w0.254: v1(40.07,38.73) 43.08,38.73 U4.12
  Bottom Layer w0.254: v1(40.07,38.73) 38.97,38.73 ; 38.97,38.73 38.97,48.86 R10.1 ; 38.97,38.73 38.97,37.12 33.97,32.12 33.97,29.29 U10.3
HID_TX: length 37.9
  Top Layer w0.254: v1(38.23,39.27) 39.73,37.77 40.64,37.77 42.29,36.12 U4.11 ; U5.3 52.84,22.61 v1(52.2,21.97)
  Inner1 w0.254: v1(38.23,39.27) 39.51,37.99 40.39,37.99 52.2,26.18 v1(52.2,21.97)
  Bottom Layer w0.254: v1(38.23,39.27) 38.22,39.28 R9.1
KEY_IN1: length 17.5
  Top Layer w0.254: v1(15.65,47.77) 14.23,47.77 ; v1(26.42,40.88) 27.19,40.12 U4.4
  Inner1 w0.254: v1(15.65,47.77) 22.54,40.88 v1(26.42,40.88)
KEY_IN2: length 54.7
  Top Layer w0.254: U4.10 43.12,33.54 v1(40.78,33.54) ; 6.23,53.92 6.23,47.32 6.55,47 v1(10.23,47)
  Inner2 w0.254: v1(10.23,47) 15.57,41.66 22.64,41.66 25.58,38.71 25.78,38.71 25.78,37.44 25.58,37.44 25.38,37.24 25.38,36.2 25.59,35.99 25.82,36.22 26.86,36.22 27.1,35.99 31.85,35.99 34.3,33.54 v1(40.78,33.54)
  Bottom Layer w0.254: R8.2 40.78,32.67 v1(40.78,33.54)
KEY_OUT: length 44.8
  Top Layer w0.254: U4.14 38.97,42.12 36.14,44.94 38.97,47.77 49.1,47.77 50.35,46.52 62.78,46.52 CN2.3 CN2.3
LCD_DC: length 32.5
  Top Layer w0.254: v1(2.36,32.27) U1.6 ; v1(23.77,37.54) 23.99,37.76 24.35,37.76 24.51,37.6 24.51,37.44 25.78,37.44 25.78,37.6 25.95,37.76 26.2,37.76 26.62,37.34 26.62,36.53 27.03,36.12 U4.6
  Inner2 w0.254: v1(2.36,32.27) 2.63,32.54 2.63,34.9 5.27,37.54 v1(23.77,37.54)
LCD_SCL: length 41.3
  Top Layer w0.254: v1(2.36,24.65) U1.3 ; U4.5 28.48,38.23 25.3,38.23 v1(25.15,38.07)
  Inner1 w0.254: v1(25.15,38.07) 25.15,35.18 13.66,35.18 13.66,35.22 12.39,35.22 12.39,33.94 12.63,33.94 12.63,24.65 v1(2.36,24.65)
LCD_SDA: length 30.1
  Top Layer w0.254: v1(25.49,33.85) 28.32,33.85 U4.7 ; v1(2.36,27.19) U1.4
  Inner2 w0.254: v1(25.49,33.85) 18.83,27.19 v1(2.36,27.19)
RST: length 134.2
  Top Layer w0.254: U4.1 29.21,46.74 v1(29.21,46.92) ; SW1.1 60.53,1.81 v1(59.83,1.11) ; v1(49.99,48.53) v1(48.62,48.53) 24.39,48.53 15.54,39.69 14.79,39.69 4.83,29.73 U1.5
  Inner1 w0.254: v1(59.83,1.11) 59.83,33.53 49.99,43.37 v1(49.99,48.53)
  Inner2 w0.254: v1(48.62,48.53) 30.82,48.53 v1(29.21,46.92)
  Bottom Layer w0.254: v1(29.21,46.92) 29.21,49.1 R5.2 ; v1(48.62,48.53) 48.58,48.57 C3.1
RTS: length 36.4
  Top Layer w0.254: v1(13.33,17.79) 13.33,20.75 12.88,21.2 12.87,21.2 12.85,21.22 12.85,21.53 12.52,21.85 U7.14
  Inner1 w0.254: v1(13.33,17.79) 15.33,19.79 15.33,24.32 15.54,24.53 15.54,25.59 15.33,25.8 15.33,30.84 19.15,34.66 25.41,34.66 v1(26.34,35.59)
  Bottom Layer w0.254: v1(26.34,35.59) 28.22,37.46 R13.2 ; U9.2 13.33,16.83 v1(13.33,17.79)
RXD: length 58.8
  Top Layer w0.254: U4.15 44.16,44.12 49.61,38.66 49.61,35.4 43.84,29.62 26.75,29.62 24.69,27.57 15.41,27.57 14.48,26.63 14.48,25.8 14.27,25.59 14.27,24.53 14.48,24.32 14.48,22.98 14.58,22.88 14.58,21.71 14.48,21.61 15.51,20.58 U7.2
TXD: length 58.2
  Top Layer w0.254: U4.16 43.92,45.89 44.54,45.89 52.2,38.24 52.2,29.98 50.55,28.33 36.58,28.33 30.1,21.85 U7.3
UD+: length 41.2
  Top Layer w0.254: v1(39.12,6.49) 38.26,5.63 31.85,5.63 31.48,5.99 ; USB1.A6 30.48,6.7 30.62,6.56 30.62,6.31 30.94,5.99 31.48,5.99 ; 31.48,5.99 USB1.B6 ; v1(50.8,26.42) U5.6
  Inner1 w0.254: v1(50.8,26.42) 50.8,20.99 39.3,9.49 39.35,9.49 39.39,9.44 39.39,8.27 39.12,7.99 v1(39.12,6.49)
UD-: length 46.4
  Top Layer w0.254: v1(53.79,27.88) 54.88,27.88 U5.7 ; v1(29.99,5.99) 29.98,5.99 USB1.B7 29.98,8.64 30.48,9.14 30.98,8.64 USB1.A7
  Inner1 w0.254: v1(53.79,27.88) 53.79,20.79 52.34,19.34 49.7,19.34 42.45,12.1 42.45,8.76 38.55,4.85 31.12,4.85 v1(29.99,5.99)
$3N2016: length 28.2
  Top Layer w0.254: v1(22.28,19.17) 30.43,19.17 U3.4
  Inner1 w0.254: v1(20.45,33.62) 20.45,21 v1(22.28,19.17)
  Bottom Layer w0.254: C2.2 20.45,37.1 v1(20.45,33.62)
$3N2525: length 53.6
  Top Layer w0.254: v1(4.15,6.19) 4.22,6.27 USB2.A5
  Bottom Layer w0.254: R4.1 9.73,35.38 11.06,34.05 12.33,34.05 12.44,33.94 13.6,33.94 13.65,33.99 16.89,30.75 16.89,7.52 10.52,1.15 9.19,1.15 v1(4.15,6.19)
$3N2666: length 8.7
  Top Layer w0.254: v1(5.47,10.94) 7.22,9.19 USB2.B5
  Bottom Layer w0.254: R6.1 6.47,11.94 v1(5.47,10.94)
$3N3364: length 27.5
  Inner2 w0.254: v1(26.92,27.69) 26.92,26.04 23.18,22.3 v1(13.94,22.3)
  Bottom Layer w0.254: R12.1 28.22,28.99 v1(26.92,27.69) ; v1(13.94,22.3) 11.21,19.57 U9.1
$3N3367: length 28.4
  Inner1 w0.254: 30.53,30.04 25.95,25.46 23.66,25.46 21.48,23.28 21.48,22.95 23.51,20.93 v1(23.51,17.15) ; 30.66,30.04 v1(30.66,37.31)
  Bottom Layer w0.254: U10.1 23.53,17.13 v1(23.51,17.15) ; v1(30.66,37.31) 30.04,37.31 R13.1
$3N4807: length 5.6
  Top Layer w0.254: v1(51.94,20.07) U5.1
  Bottom Layer w0.254: v1(51.94,20.07) 51.49,19.62 C6.1
$3N4819: length 11.7
  Top Layer w0.254: U5.5 54.43,25.79 v1(46,25.79)
  Bottom Layer w0.254: C8.2 48.1,25.79 v1(46,25.79)
$3N5016: length 5.8
  Top Layer w0.254: U5.13 49.32,24.18 v1(49.66,24.52) 49.66,24.81 U5.12 ; 49.32,21.98 v1(49.72,21.98) ; 49.32,21.98 U5.14 ; 49.32,21.98 U5.15
  Inner1 w0.254: v1(49.66,24.52) 49.72,24.46 v1(49.72,21.98)
$3N5212: length 7.6
  Top Layer w0.254: v1(28.9,9.14) 29.48,8.56 USB1.A5
  Bottom Layer w0.254: v1(28.9,9.14) 30.89,7.16 R2.1
$3N5218: length 19.8
  Top Layer w0.254: USB1.B5 32.48,8.42 v1(31.88,9.03)
  Inner2 w0.254: v1(38.76,8.86) 32.05,8.86 v1(31.88,9.03)
  Bottom Layer w0.254: v1(38.76,8.86) 39.73,9.82 R3.1
$3N5338: length 13.6
  Top Layer w0.254: v1(65.01,24.27) 65.01,24.17 U6.2
  Inner1 w0.254: BUZZER1.1 64.1,14.1 64.1,23.36 v1(65.01,24.27)
$3N5513: length 184.6
  Top Layer w0.254: U2.1 68.33,40.02 v1(68.33,39.47) ; 40.38,17.43 38.81,18.99 U3.3 ; 40.38,17.43 33.48,17.43 U3.1 ; 40.38,17.43 40.38,6.68 38.55,4.85 12.86,4.85 v1(12.32,5.4)
  Inner2 w0.254: v1(12.32,5.4) 17.94,11.02 65.35,11.02 68.33,13.99 v1(68.33,39.47)
  Bottom Layer w0.254: v1(12.32,5.4) 11.43,6.29 11.43,12.94 8.98,15.39 8.98,42.75 R1.2
$3N5795: length 39.8
  Bottom Layer w0.254: U8.2 50.8,12.88 58.52,20.6 58.52,27.07 49.79,35.8 R11.1
$3N5844: length 50.6
  Top Layer w0.254: LED1.1 v1(68.58,1.8)
  Bottom Layer w0.254: R11.2 65.07,36.46 68.58,32.94 v1(68.58,1.8)

## Text on the board
Top Silkscreen Layer: 供电/下载 | 电键输入 | HID输出 | 电键输出 | 总开关 | LED开关 | 蜂鸣器开关
